# EAGLE design FTPSC (EAGLE 6.3)
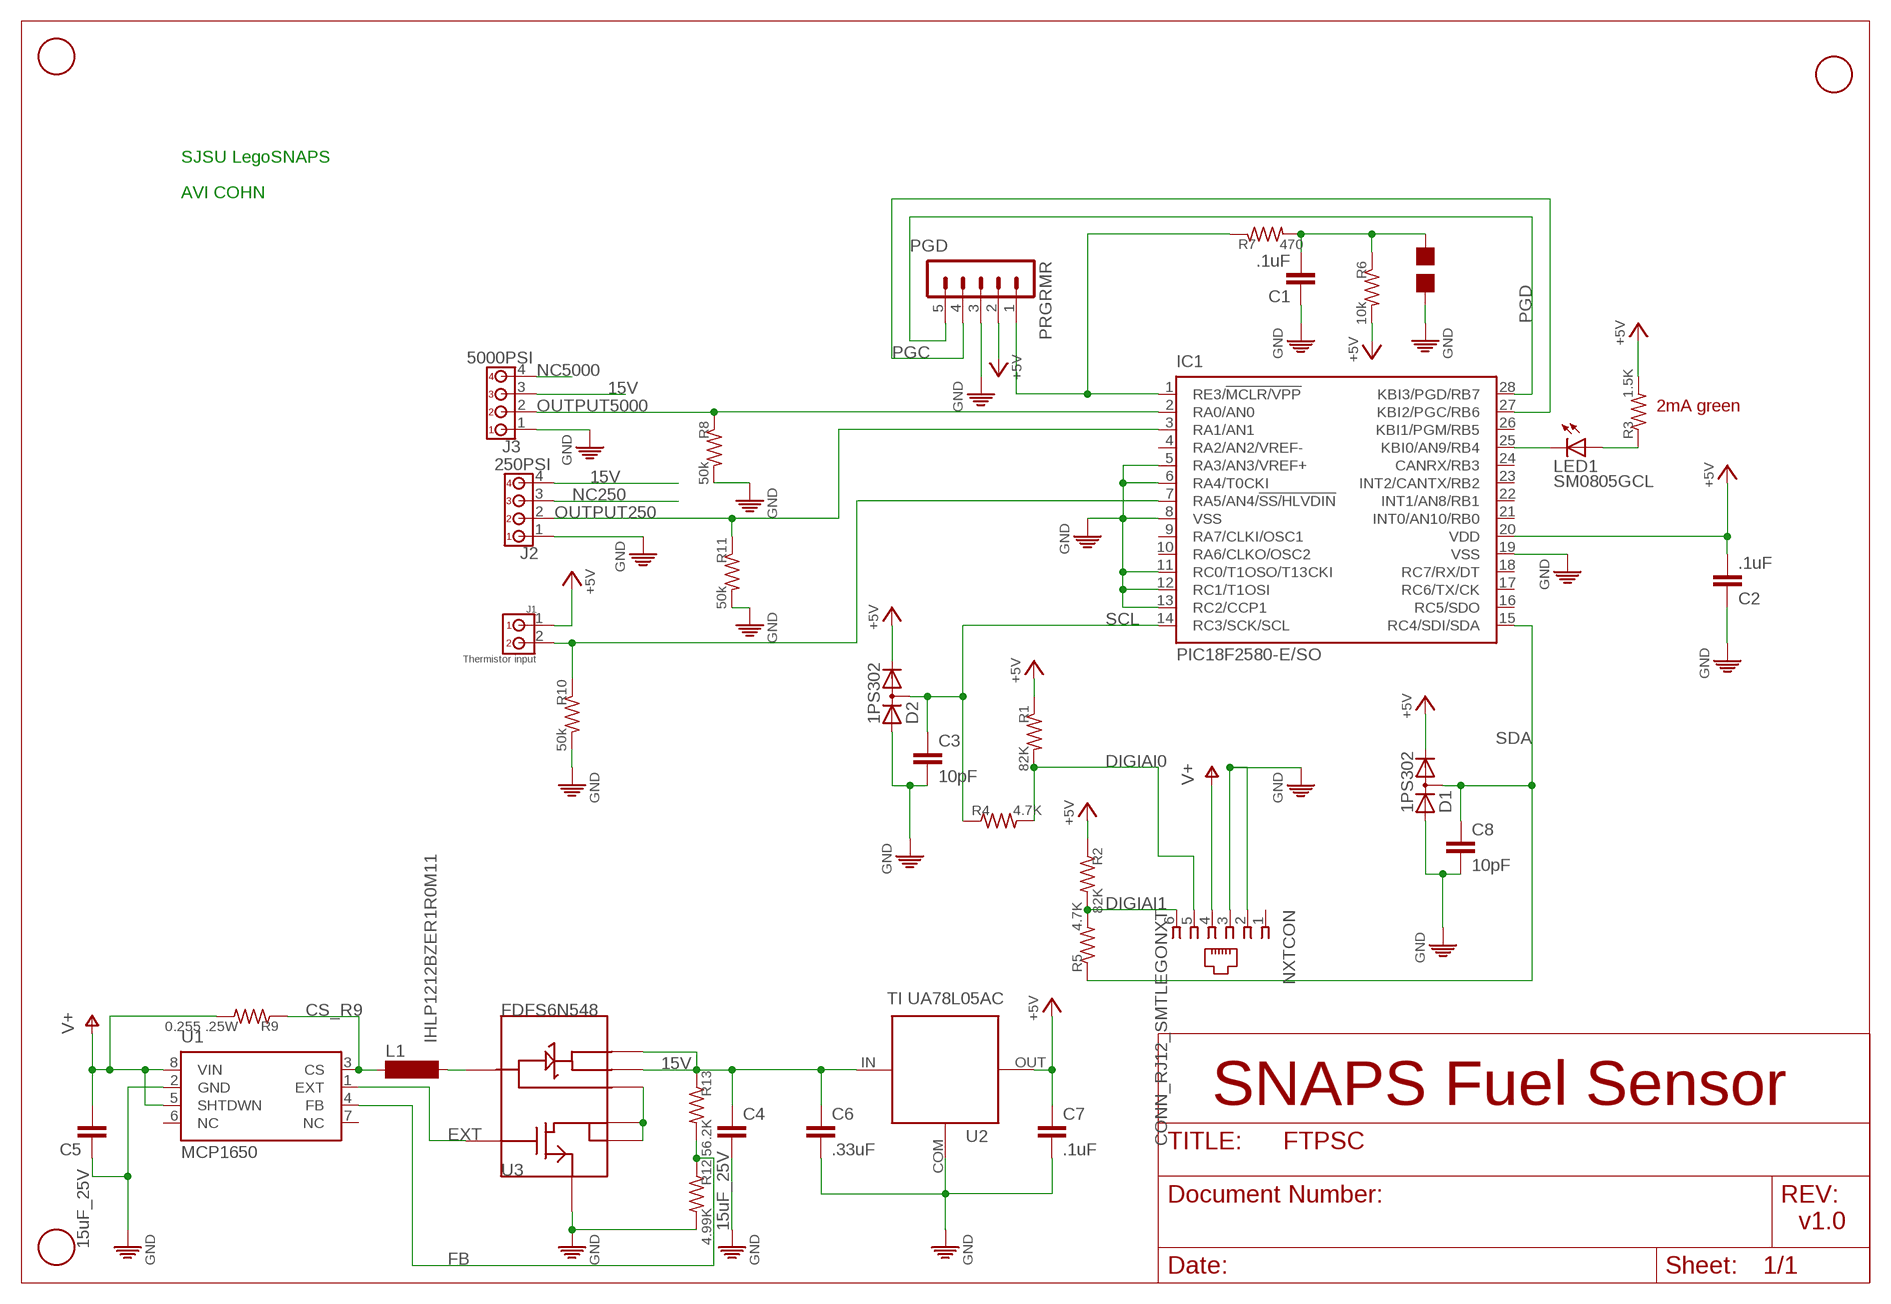
[diagram p0: schematic, sheet 1]

## Parts
C1  .1uF  PASSIVE_CAP_NON-POLC0805  [RCL_C0805]
C2  .1uF  PASSIVE_CAP_NON-POLC0805  [RCL_C0805]
C3  10pF  PASSIVE_CAP_NON-POLC0805  [RCL_C0805]
C4  15uF_25V  PASSIVE_CAP_NON-POLC0805  [RCL_C0805]
C5  15uF_25V  PASSIVE_CAP_NON-POLC0805  [RCL_C0805]
C6  .33uF  PASSIVE_CAP_NON-POLC0805  [RCL_C0805]
C7  .1uF  PASSIVE_CAP_NON-POLC0805  [RCL_C0805]
C8  10pF  PASSIVE_CAP_NON-POLC0805  [RCL_C0805]
D1  1PS302  DIOD_DBL_SERIESSOT323  [SC70-3-R]
D2  1PS302  DIOD_DBL_SERIESSOT323  [SC70-3-R]
IC1  PIC18F2580-E/SO  [SO28W]
J1  Thermistor input  CONN_KK_2-PIN  [CON-MOLEX_22-23-2021]
J2  250PSI  CONN_KK_4-PIN  [CON-MOLEX_22-23-2041]
J3  5000PSI  CONN_KK_4-PIN  [CON-MOLEX_22-23-2041]
L1  IHLP1212BZER1R0M11  MS42  [MS42]
LED1  SM0805GCL  LEDD0805  [D0805]
NXTCON  CONN_RJ12_SMTLEGONXT  [NXTCONN]
PRGRMR  CONN_5-PIN  [CONN_5-PIN]
R1  82K  PASSIVE_RESISTORM0805  [RCL_M0805]
R2  82K  PASSIVE_RESISTORM0805  [RCL_M0805]
R3  1.5K  PASSIVE_RESISTORM0805  [RCL_M0805]
R4  4.7K  PASSIVE_RESISTORM0805  [RCL_M0805]
R5  4.7K  PASSIVE_RESISTORM0805  [RCL_M0805]
R6  10k  PASSIVE_RESISTORM0805  [RCL_M0805]
R7  470  PASSIVE_RESISTORM0805  [RCL_M0805]
R8  50k  PASSIVE_RESISTORM0805  [RCL_M0805]
R9  0.255 .25W  PASSIVE_RESISTORM0805  [RCL_M0805]
R10  50k  PASSIVE_RESISTORM0805  [RCL_M0805]
R11  50k  PASSIVE_RESISTORM0805  [RCL_M0805]
R12  4.99K  PASSIVE_RESISTORM0805  [RCL_M0805]
R13  56.2K  PASSIVE_RESISTORM0805  [RCL_M0805]
T1  PAD-PAIR  [P0805]
U1  MCP1650  MCP165001  [SOP-08]
U2  TI UA78L05AC  VREG_3PINSOT89  [SOT-89]
U3  FDFS6N548  MOSFET/SCOTTKY  [SO8]
U$1  FIDUCIAL  [FIDUCIAL_1MM]
U$2  FIDUCIAL  [FIDUCIAL_1MM]
U$3  FIDUCIAL  [FIDUCIAL_1MM]

## Nets
15V: C4.1 C6.1 J2.4 J3.3 R13.1 U2.IN U3.7(C) U3.8(C)
+5V: C2.2 C7.1 D1.2(C) D2.2(C) IC1.20(VDD) J1.1 PRGRMR.2 R1.1 R2.1 R3.2 R6.2 U2.OUT
CS_R9: L1.1 R9.1 U1.3(CS)
DIGIAI0: NXTCON.5 R1.2 R4.2
DIGIAI1: NXTCON.6 R2.2 R5.2
EXT: U1.1(EXT) U3.4(G)
FB: R12.1 R13.2 U1.4(FB)
GND: C1.1 C2.1 C3.2 C4.2 C5.1 C6.2 C7.2 C8.2 D1.1(A) D2.1(A) IC1.5(RA3/AN3/VREF+) IC1.6(RA4/T0CKI) IC1.8(VSS) IC1.11(RC0/T1OSO/T13CKI) IC1.12(RC1/T1OSI) IC1.13(RC2/CCP1) IC1.19(VSS) J2.1 J3.1 NXTCON.2 NXTCON.3 PRGRMR.3 R8.2 R10.2 R11.2 R12.2 T1.1 U1.2(GND) U2.COM U3.3(S)
N$1: IC1.1(RE3/!MCLR/VPP) PRGRMR.1 R7.1
N$2: IC1.25(KBI0/AN9/RB4) LED1.C
N$3: LED1.A R3.1
N$6: C1.2 R6.1 R7.2 T1.2
N$7: L1.2 U3.1(A)
N$8: IC1.7(RA5/AN4/!SS/HLVDIN) J1.2 R10.1
N$10: U3.2(A) U3.5(D) U3.6(D)
NC250: J2.3
NC5000: J3.4
OUTPUT250: IC1.3(RA1/AN1) J2.2 R11.1
OUTPUT5000: IC1.2(RA0/AN0) J3.2 R8.1
PGC: IC1.27(KBI2/PGC/RB6) PRGRMR.4
PGD: IC1.28(KBI3/PGD/RB7) PRGRMR.5
SCL: C3.1 D2.3(AC) IC1.14(RC3/SCK/SCL) R4.1
SDA: C8.1 D1.3(AC) IC1.15(RC4/SDI/SDA) R5.1
V+: C5.2 NXTCON.4 R9.2 U1.5(SHTDWN) U1.8(VIN)
Unconnected: IC1.4(RA2/AN2/VREF-) IC1.9(RA7/CLKI/OSC1) IC1.10(RA6/CLKO/OSC2) IC1.16(RC5/SDO) IC1.17(RC6/TX/CK) IC1.18(RC7/RX/DT) IC1.21(INT0/AN10/RB0) IC1.22(INT1/AN8/RB1) IC1.23(INT2/CANTX/RB2) IC1.24(CANRX/RB3) IC1.26(KBI1/PGM/RB5) NXTCON.1 U1.6(NC) U1.7(NC)

## Notes on the sheet
- SJSU LegoSNAPS
- AVI COHN
- 2mA green
- SNAPS Fuel Sensor
- v1.0

## Library data of the parts
C1-C8 = BobsSnapsLib:PASSIVE_CAP_NON-POL: CAPACITOR, European symbol
D1 D2 = BobsSnapsLib:DIOD_DBL_SERIES: DIODE low-leakage double diode
IC1 = SNAPS_FPTSC_lib:PIC18F2*80: 28-Pin Enhanced Flash Microcontrollers with ECAN(TM) Technology 10-Bit A/D and nanoWatt Technology Source: http://www.microchip.com .. 39637a.pdf; MF: MICROCHIP; MPN: PIC18F2580-I/SO; OC_FARNELL: 9321284; OC_NEWARK: 71J7243
J1 = BobsSnapsLib:CONN_KK_2-PIN: 2-pin Molex KK header .1"
J2 J3 = BobsSnapsLib:CONN_KK_4-PIN: 4-pin Molex .1" KK header
L1 = SNAPS_FPTSC_lib:MS42: INDUCTOR SMD inductor; OC_FARNELL: unknown; OC_NEWARK: unknown
LED1 = SNAPS_FPTSC_lib:LED: Low Current (2mA) LED 3 mm Tinted Diffused Package color YELLOW Source: Data sheet <http://www.farnell.com/datasheets/391098.pdf>
NXTCON = BobsSnapsLib:CONN_RJ12_SMT: AMP connector
PRGRMR = BobsSnapsLib:CONN_5-PIN: 5-Pin Right Angle Header
R1-R13 = BobsSnapsLib:PASSIVE_RESISTOR: RESISTOR, American symbol
T1 = SpecialSymbols:PAD-PAIR
U1 = SNAPS_FPTSC_lib:MCP1650: Microchip MCP1650 DC/DC Converter; MF: TEXAS INSTRUMENT CONNECTORS; MPN: TPS77301DGK; OC_FARNELL: 1510194; OC_NEWARK: 77C1213
U2 = SNAPS_FPTSC_lib:VREG_3PIN: generic 3pin voltage regulator
U3 = SNAPS_FPTSC_lib:MOSFET/SCOTTKY: mosfet/schottky
U$1-U$3 = adafruit:FIDUCIAL: For use by pick and place machines to calibrate the vision/machine, 1mm By microbuilder.eu

## Board
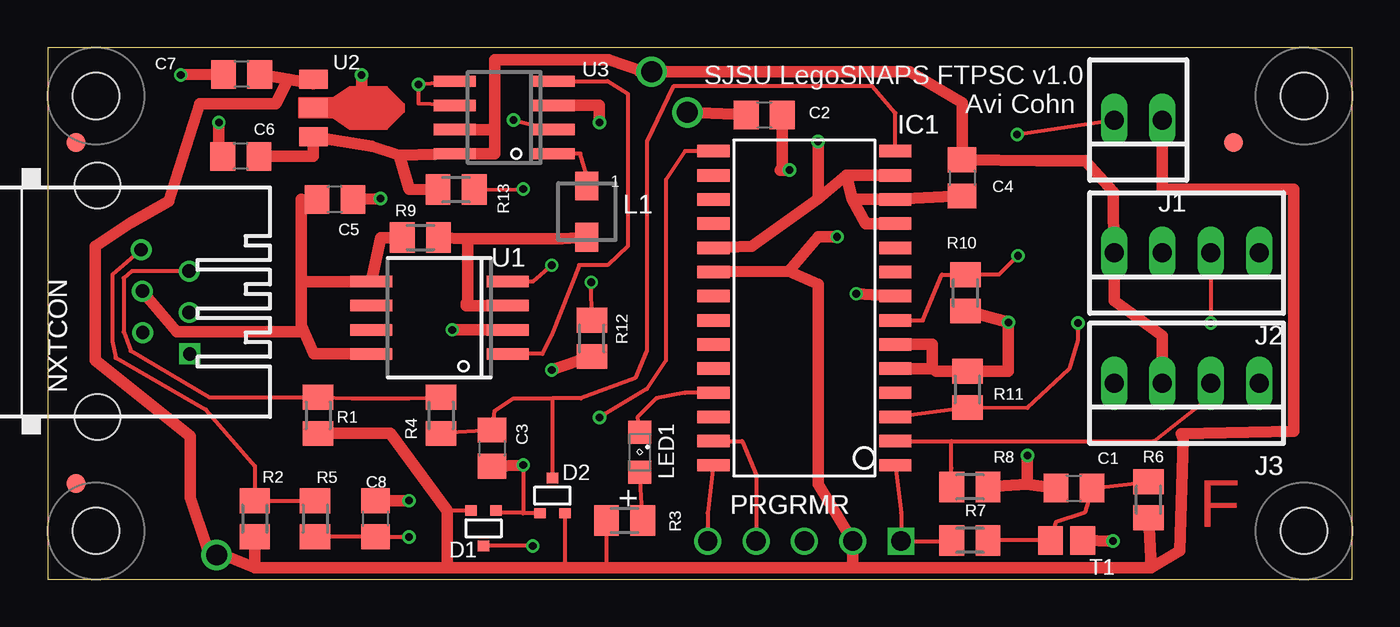
[diagram p1: board, top side]
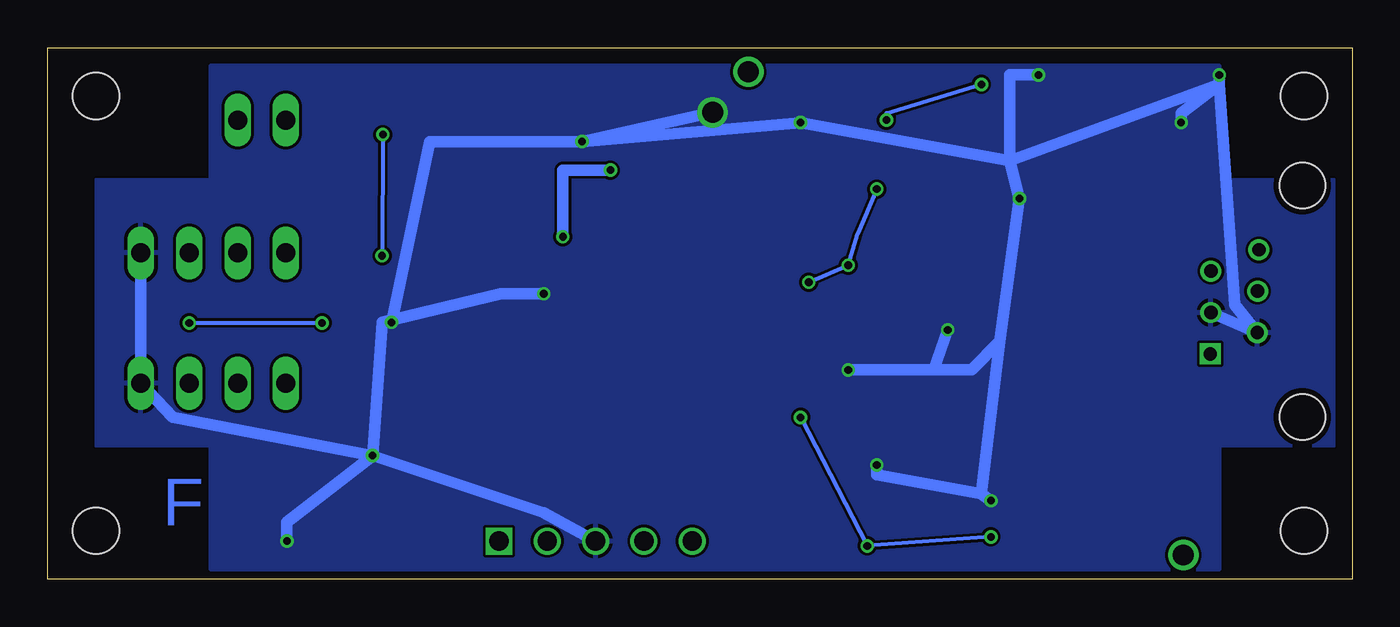
[diagram p2: board, bottom side, seen from below]

Size 68.58 x 27.94 mm. Coordinates in mm from the lower left corner, seen from the top.
Outline: 0,0 68.58,0 68.58,27.94 0,27.94 0,0
Copper layers (1*16): Top 0.035mm / dielectric 1.5mm / Bottom 0.035mm
Design rules "PCB-POOL Standard": minimum track width 0.15mm, minimum drill 0.3mm, track to track 0.15mm, track to pad 0.15mm, pad to pad 0.15mm, via to via 0.15mm, smd to smd 0.15mm, copper to edge 0.3mm, drill to drill 0.2mm, minimum pad ring 0.2mm, minimum via ring 0.15mm, stop-mask expansion 0.075mm, vias tented up to drill 0mil, thermal gap 0.2mm
Holes 2.44 mm at 2.54,2.54 66.04,2.54 2.54,25.4 66.04,25.4

### Footprints (pad centres in the part's own frame; a part is rotated, then mirrored left to right if it is on the bottom)
RCL_C0805 = smd 1.3 x 1.5: 1 -0.95,0; 2 0.95,0
SC70-3-R = smd 0.6 x 0.55: 1 -0.65,-0.925; 2 0.65,-0.925; 3 0,0.925
SO28W = smd 0.65 x 1.7: 1 -7.62,-4.78; 2 -6.35,-4.78; 3 -5.08,-4.78; 4 -3.81,-4.78; 5 -2.54,-4.78; 6 -1.27,-4.78; 7 0,-4.78; 8 1.27,-4.78; 9 2.54,-4.78; 10 3.81,-4.78; 11 5.08,-4.78; 12 6.35,-4.78; 13 7.62,-4.78; 14 8.89,-4.78; 15 8.89,4.78; 16 7.62,4.78; 17 6.35,4.78; 18 5.08,4.78; 19 3.81,4.78; 20 2.54,4.78; 21 1.27,4.78; 22 0,4.78; 23 -1.27,4.78; 24 -2.54,4.78; 25 -3.81,4.78; 26 -5.08,4.78; 27 -6.35,4.78; 28 -7.62,4.78
CON-MOLEX_22-23-2021 = drill 1 long: 1 -1.27,0; 2 1.27,0
CON-MOLEX_22-23-2041 = drill 1 long: 1 -3.81,0; 2 -1.27,0; 3 1.27,0; 4 3.81,0
MS42 = smd 1.2 x 1.5: 1 0,1.35; 2 0,-1.35
D0805 = smd 1.2 x 1.2: A 1.05,0; C -1.05,0
NXTCONN = drill 0.7 square: 1 2.764,6.84 | drill 0.7: 2 1.647,4.372; 3 0.59,6.805; 4 -0.539,4.346; 5 -1.584,6.804; 6 -2.705,4.28 | hole 2.4: -6.08,2; 6.08,2
CONN_5-PIN = drill 1.016 square: 1 -5.08,0 | drill 1.016: 2 -2.54,0; 3 0,0; 4 2.54,0; 5 5.08,0
RCL_M0805 = smd 1.3 x 1.6: 1 -0.95,0; 2 0.95,0
P0805 = smd 1.3 x 1.5: 1 -0.85,0; 2 0.85,0
SOP-08 = smd 0.6 x 2.2: 1 -1.905,-3.6; 2 -0.635,-3.6; 3 0.635,-3.6; 4 1.905,-3.6; 5 1.905,3.575; 6 0.635,3.575; 7 -0.635,3.575; 8 -1.905,3.575
SOT-89 = smd 1 x 1.5: COM 0,0; IN 1.5,0; OUT -1.5,0
SO8 = smd 0.6 x 2.2: 1 -1.905,-2.6; 2 -0.635,-2.6; 3 0.635,-2.6; 4 1.905,-2.6; 5 1.905,2.6; 6 0.635,2.6; 7 -0.635,2.6; 8 -1.905,2.6
FIDUCIAL_1MM = smd 1 x 1: 1 0,0

### Placement (x,y rotation side)
C1  53.95,4.79 0 top
C2  37.66,24.4 0 top
C3  23.36,6.89 270 top
C4  48.07,21.09 270 top
C5  15.11,19.95 180 top
C6  10.16,22.23 180 top
C7  10.2,26.54 180 top
C8  17.24,3.17 90 top
D1  22.91,2.67 180 top
D2  26.54,4.39 0 top
IC1  39.77,13.61 90 top
J1  57.33,24.13 180 top
J2  59.87,17.14 180 top
J3  59.87,10.29 180 top
L1  28.34,19.32 180 top
LED1  31.13,6.67 270 top
NXTCON  0.64,14.61 270 top
PRGRMR  39.77,2 180 top
R1  14.22,8.61 90 top
R2  10.89,3.17 90 top
R3  30.32,3.09 180 top
R4  20.68,8.61 90 top
R5  14.06,3.17 90 top
R6  57.87,4.17 270 top
R7  48.48,2.04 0 top
R8  48.48,4.85 0 top
R9  19.59,17.95 180 top
R10  48.24,15.05 270 top
R11  48.34,9.97 90 top
R12  28.61,12.65 270 top
R13  21.48,20.47 0 top
T1  53.55,2.04 180 top
U1  20.59,13.74 90 top
U2  13.97,24.77 270 top
U3  24,24.27 90 top
U$1  1.5,5.04 0 top
U$2  1.5,22.96 0 top
U$3  62.33,22.96 0 top

### Tracks (layer width: path | path; a pad name or v marks a point on that pad's centre or on a via)
15V  (via drill 1.1 pad 1.6)
  Top 0.6: J3.3 58.59,12.79 56.05,14.64 J2.4 56.02,19.14 56.02,20.38 54.52,22 52.02,22 C4.1 48.09,25.04 45.31,26.67 v31.75,26.67 31.34,26.67 | C6.1 13.97,22.23 U2.IN 17.05,22.77 18.49,22.28 | 23.5,23.63 U3.7 | 23.5,23.63 23.5,22.36 U3.8 18.49,22.28 | 31.34,26.67 29.5,27.3 23.5,27.3 23.5,23.63 | 31.34,26.67 31.11,26.67 | 18.49,22.28 19,20.5 R13.1
+5V  (via drill 0.4, 1.1 pad 1.6)
  Top 0.2: D1.2 21,3.6 | D2.2 27.18,0.6 | R3.2 29.38,0.6
  Top 0.406: 13.97,26.04 U2.OUT
  Top 0.6: C7.1 12.64,26.27 | 12.64,26.27 13.97,26.04 | R6.2 58,0.6 | 58,0.6 42.31,0.6 | 42.31,0.6 PRGRMR.2 40.5,5 40.5,15.5 38.96,16.18 | 12.64,26.27 12,25 8,25 6.37,19.86 4.37,18.73 2.5,17.5 2.5,11.5 7.5,7.5 7.5,4.27 8.39,1.63 | 42.31,0.6 29.38,0.6 27.18,0.6 21,0.6 | 21,0.6 10.89,0.6 | 10.89,0.6 8.39,1.63 | R2.1 10.89,0.6 | R1.1 18,7.66 21,3.6 21,0.6 | J1.1 58.59,20.5 65.5,20.5 65.5,7.77 59.59,7.63 59.69,7.37 59.5,1.5 58,0.6 | 38.96,16.18 IC1.20 | v8.89,1.27 8.39,1.63 | v41.5,18 40.5,18 38.96,16.18 | v39,21.5 38.5,21.5 38.62,21.61 C2.2
  Bottom 0.6: v39,21.5 41.5,21.5 v41.5,18
CS_R9
  Top 0.6: R9.1 22.1,17.9 | 22.1,17.9 27.01,17.9 L1.1 | U1.3 22,14.38 22,14.5 22.1,14.5 22.1,17.9
DIGIAI0
  Top 0.2: NXTCON.5 4.43,16.19 4,15.82 4,13 4.37,12 8.5,9.56 R1.2 16,9.5 19,9.5 R4.2
DIGIAI1
  Top 0.2: NXTCON.6 3.4,16 3.4,12.5 3.58,11.63 8.32,8.9 10.89,5.95 R2.2 R5.2
EXT
  Top 0.2: U3.4 29.44,26.17 30.5,25.5 30.5,17.5 29.44,16.5 27.94,16.5 26.5,12.84 26,11.84 U1.1
FB  (via drill 0.4)
  Top 0.2: R12.1 v28.57,15.61 | U1.4 25.5,15.64 v26.5,16.5 | R13.2 v25,20.5
  Bottom 0.2: v25,20.5 26,18.14 v26.5,16.5 v28.57,15.61
GND  (via drill 0.4, 1.1 pad 1.6)
  Top 0.2: v25,6 25,3.5 | 25,3.5 23.57,3.5 D1.1 | D2.1 25,3.46 25,3.5
  Top 0.6: C2.1 v33.62,24.54 | v40.5,23 40.5,20 | 40.5,20 41.97,21.23 | 41.97,21.23 IC1.13 | IC1.11 43,18.68 42.29,19.96 | 42.29,19.96 41.97,21.23 | 42.29,19.96 IC1.12 C4.2 | 40.5,20 37,17.5 IC1.19 | U3.3 29,24.9 v29,24 | C7.2 v7,26.5 | C5.1 v17.5,20 | U2.COM 16.5,24.5 v16.5,26.5 | C8.2 v19,4.12 | C3.2 v25,6 | U1.2 v21.27,13.11 | R12.2 v26.5,11 | v51.5,6.5 51.5,5 | 51.5,5 R8.2 | 51.5,5 C1.1 | T1.1 v56,2 | R10.2 v50.5,13.5 50.5,10.93 R11.2 46.7,10.93 46.5,11.06 | 46.5,11.06 IC1.5 | IC1.8 v42.5,15 | IC1.6 46.5,12.34 46.5,11.06 | C6.2 9,22.23 v9,24
  Bottom 0.6: v33.62,24.54 v40.5,23 | v40.5,23 v29,24 18,22 | NXTCON.3 NXTCON.2 6.19,14.42 7,26 | v7,26.5 7,26 | 18,22 v17.5,20 18.53,12.5 | 18,22 7,26 | v16.5,26.5 18,26.5 18,22 | v19,4.12 19.5,4.5 | 19.5,4.5 18.53,12.5 | v25,6 25,5.5 19.5,4.5 | v21.27,13.11 22,11 | 22,11 20,11 18.53,12.5 | v26.5,11 22,11 | J2.1 J3.1 62,8.5 v51.5,6.5 | v56,2 56,3 v51.5,6.5 | PRGRMR.3 42.5,3.5 v51.5,6.5 | 51,13.5 v50.5,13.5 48.5,23 v40.5,23 | 51,13.5 v51.5,6.5 | v42.5,15 44.77,15 51,13.5 | v9,24 9,24.5 7,26
  pour Bottom: 7,0.5 60,0.5 60,7 66,7 66,21 60,21 60,27 7,27 7,21 1,21 1,7 7,7
N$1
  Top 0.2: IC1.1 44.85,3.48 PRGRMR.1 47.53,2 R7.1
N$2
  Top 0.2: IC1.25 33.5,9.79 32,9.5 31,8.5 LED1.C
N$3
  Top 0.2: R3.1 LED1.A
N$6
  Top 0.2: R7.2 T1.2 53,3 54.5,3.5 C1.2 R6.1
N$7
  Top 0.2: L1.2 28.5,20.67 28,22.36 U3.1
N$8  (via drill 0.4)
  Top 0.2: J1.2 v50.96,23.36 | v51,17 50,16 R10.1 47,16 46,13.61 IC1.7
  Bottom 0.2: v50.96,23.36 v51,17
N$10  (via drill 0.4)
  Top 0.2: v24.5,24.13 U3.2 | U3.5 v19.5,26 19.5,25 U3.6
  Bottom 0.2: v24.5,24.13 24.5,24.5 v19.5,26
OUTPUT250  (via drill 0.4)
  Top 0.2: J2.2 v61.13,13.47 | v54.15,13.47 54.15,12.56 53.7,11.06 51.5,9 R11.1 IC1.3
  Bottom 0.2: v61.13,13.47 v54.15,13.47
OUTPUT5000
  Top 0.2: IC1.2 47.5,7.25 | 47.5,7.25 58.13,7.25 61,9.5 J3.2 | R8.1 47.5,5.85 47.5,7.25
PGC
  Top 0.2: IC1.27 36.5,7.25 37.23,5.5 PRGRMR.4
PGD
  Top 0.2: IC1.28 34.7,3.48 PRGRMR.5
SCL
  Top 0.2: IC1.14 44.55,24.5 43.35,25.9 32.88,25.9 31.5,23 31.5,12 30.89,10.56 28.04,9.5 26.54,9.5 | 26.54,9.5 D2.3 | R4.1 C3.1 23.5,8.84 24.5,9.5 26.54,9.5
SDA  (via drill 0.4)
  Top 0.2: R5.1 C8.1 v19,2.23 | IC1.15 33.5,22.5 32.5,21 32.5,11.5 31.5,10 v29,8.5 | v25.5,1.75 D1.3
  Bottom 0.2: v29,8.5 v25.5,1.75 v19,2.23
V+
  Top 0.406: C5.2 13.34,19.95
  Top 0.6: 13.34,19.95 13.34,15.64 | 13.34,15.64 13.34,13.34 | 13.34,13.34 13.34,13 6.8,13 NXTCON.4 | U1.8 14,11.84 13.34,13.34 | R9.2 17.52,17.95 U1.5 13.34,15.64

### Text on the board
Top: F
Bottom: F
tPlace: SJSU LegoSNAPS FTPSC v1.0 | Avi Cohn
_tNames: C7 | U2 | U3 | C2 | C6 | IC1 | R9 | C4 | J1 | C5 | R13 | L1 | R10 | U1 | R12 | J2 | NXTCON | R1 | R11 | C3 | LED1 | R4 | R5 | R8 | C1 | R6 | J3 | R2 | C8 | D2 | R3 | PRGRMR | R7 | D1 | T1